# EAGLE design test (EAGLE 9.6.2)
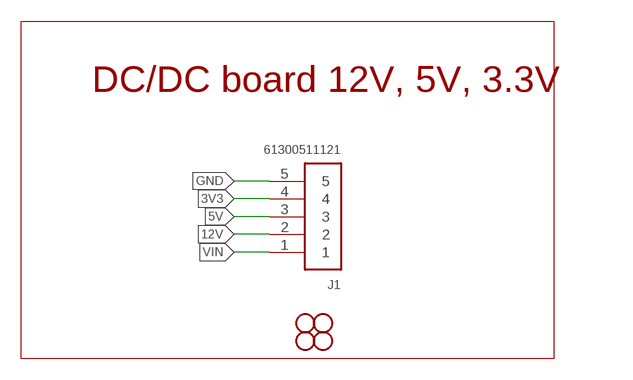
[diagram p0: schematic, sheet 1]

## Parts
J1  61300511121  [61300511121]
JP2  STAND-OFF  [STAND-OFF]
JP3  STAND-OFF  [STAND-OFF]
JP8  STAND-OFF  [STAND-OFF]
JP9  STAND-OFF  [STAND-OFF]

## Nets
3V3: J1.4
5V: J1.3
12V: J1.2
GND: J1.5
VIN: J1.1

## Notes on the sheet
- DC/DC board 12V, 5V, 3.3V

## Library data of the parts
J1 = Headers:61300511121: CONN HEADER VERT 5POS 2.54MM Manufacturer's datasheet <https://katalog.we-online.de/em/datasheet/6130xx11121.pdf>; CREATED_BY: PCBLayout.com; DIGI_KEY_PART_NUMBER: 732-5318-ND; MANUFACTURER: Wurth Electronics Inc.; MPN: 61300511121
JP2 JP3 JP8 JP9 = SparkFun:STAND-OFF: Stand Off This is the mechanical footprint for a #4 phillips button head screw. Use the keepout ring to avoid running the screw head into surrounding components. SKU : PRT-00447

## Board
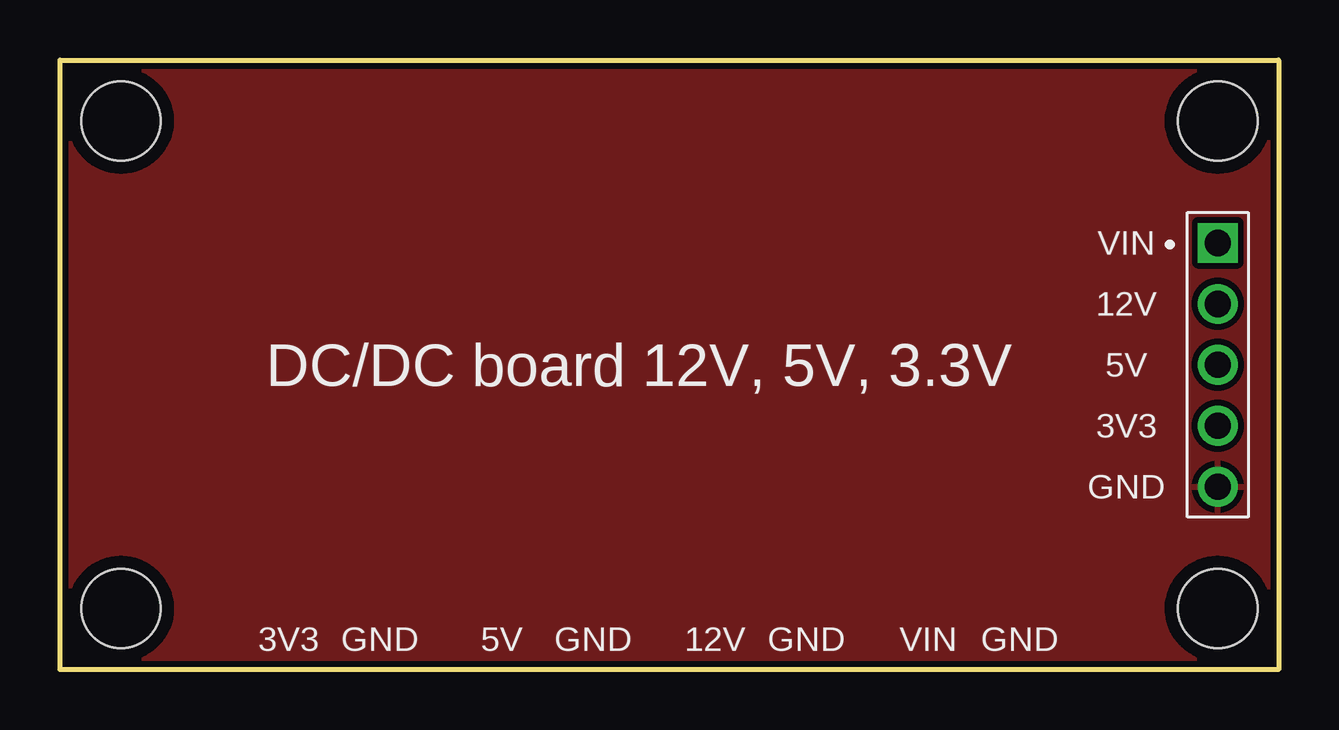
[diagram p1: board, top side]
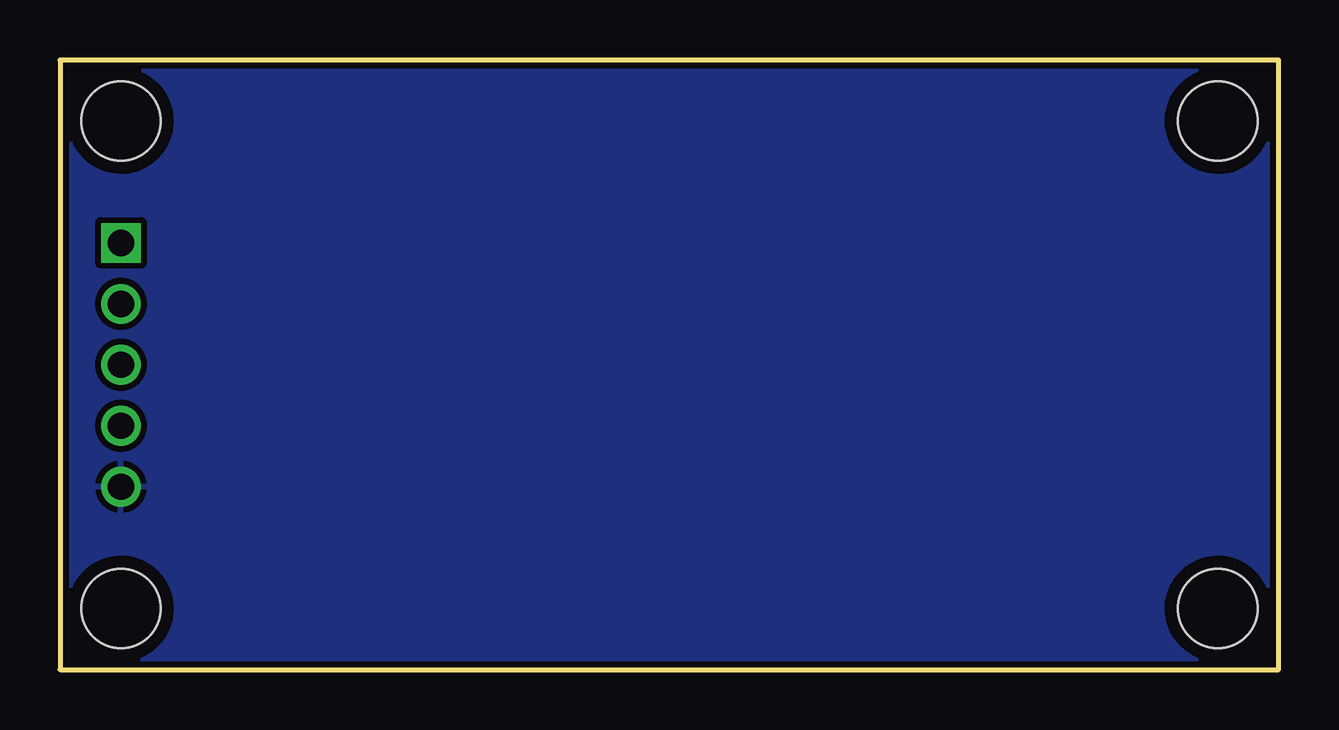
[diagram p2: board, bottom side, seen from below]

Size 50.8 x 25.4 mm. Coordinates in mm from the lower left corner, seen from the top.
Outline: 0,0 0,25.4 50.8,25.4 50.8,0 0,0
Copper layers (1*16): Top 0.035mm / dielectric 1.5mm / Bottom 0.035mm
Design rules "SparkFun-2-layer-TIGHT": minimum track width 7mil, minimum drill 15mil, track to track 7mil, track to pad 7mil, pad to pad 7mil, via to via 7mil, smd to smd 7mil, copper to edge 7mil, drill to drill 7mil, minimum pad ring 7mil, minimum via ring 7mil, stop-mask expansion 4mil, vias tented up to drill 25mil, thermal gap 10mil

### Footprints (pad centres in the part's own frame; a part is rotated, then mirrored left to right if it is on the bottom)
61300511121 = drill 1.1 square: 1 -5.08,0 | drill 1.1: 2 -2.54,0; 3 0,0; 4 2.54,0; 5 5.08,0
STAND-OFF = hole 3.302: 0,0

### Placement (x,y rotation side)
J1  48.26,12.7 270 top
JP2  2.54,2.54 0 top
JP3  48.26,2.54 0 top
JP8  48.26,22.86 0 top
JP9  2.54,22.86 0 top

### Tracks (layer width: path | path; a pad name or v marks a point on that pad's centre or on a via)
GND
  pour Top (isolate 0.254): 50.8,0 50.8,25.4 0,25.4 0,0
  pour Bottom (isolate 0.254): 50.8,0 50.8,25.4 0,25.4 0,0

### Text on the board
tPlace: VIN | 12V | DC/DC board 12V, 5V, 3.3V | 5V | 3V3 | GND | 3V3 | GND | 5V | GND | 12V | GND | VIN | GND